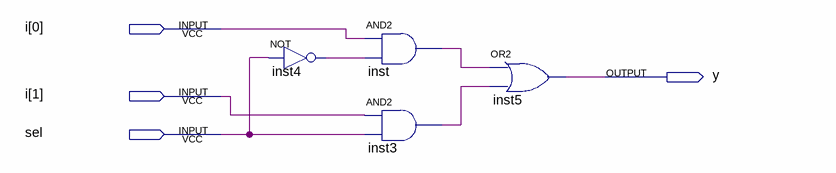
[diagram p0: schematic sheet]
// Quartus schematic mux2.bdf as structural Verilog: 4 symbols, 4 pins
module mux2 (
  input  [1:0] i,
  input  sel,
  output y
);

  wire inst3_out, inst4_out, inst_out;

  not inst4 (inst4_out, sel);
  and inst (inst_out, i[0], inst4_out);
  and inst3 (inst3_out, i[1], sel);
  or inst5 (y, inst_out, inst3_out);
endmodule
